# Altium schematic sheet Top_board.SchDoc
size A4
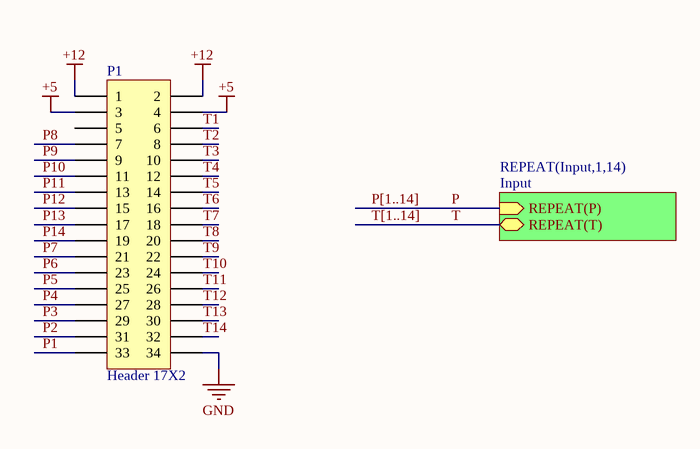
[diagram p0: Top_board.SchDoc]

## Parts
P1  Header 17X2  [HDR2X17-PLC]

## Sub-sheets
REPEAT(Input,1,14) = Input: REPEAT(P) (in), REPEAT(T) (bidir)

## Nets
+5: P1.3 P1.4
+12: P1.1 P1.2
GND: P1.34
P: sheet REPEAT(Input,1,14)/REPEAT(P)
P1: P1.33
P2: P1.31
P3: P1.29
P4: P1.27
P5: P1.25
P6: P1.23
P7: P1.21
P8: P1.7
P9: P1.9
P10: P1.11
P11: P1.13
P12: P1.15
P13: P1.17
P14: P1.19
T: sheet REPEAT(Input,1,14)/REPEAT(T)
T1: P1.6
T2: P1.8
T3: P1.10
T4: P1.12
T5: P1.14
T6: P1.16
T7: P1.18
T8: P1.20
T9: P1.22
T10: P1.24
T11: P1.26
T12: P1.28
T13: P1.30
T14: P1.32

Not connected (* = marked no-connect by the designer): P1 5

## Buses and harness runs
bus P[1..14]
bus T[1..14]

## Library data of the parts
P1 = Header 17X2: Header, 17-Pin, Dual row; LatestRevisionDate: 17-Jul-2002; LatestRevisionNote: Re-released for DXP Platform.; Publisher: Altium Limited